# Altium schematic sheet Sheet1.SchDoc
size A
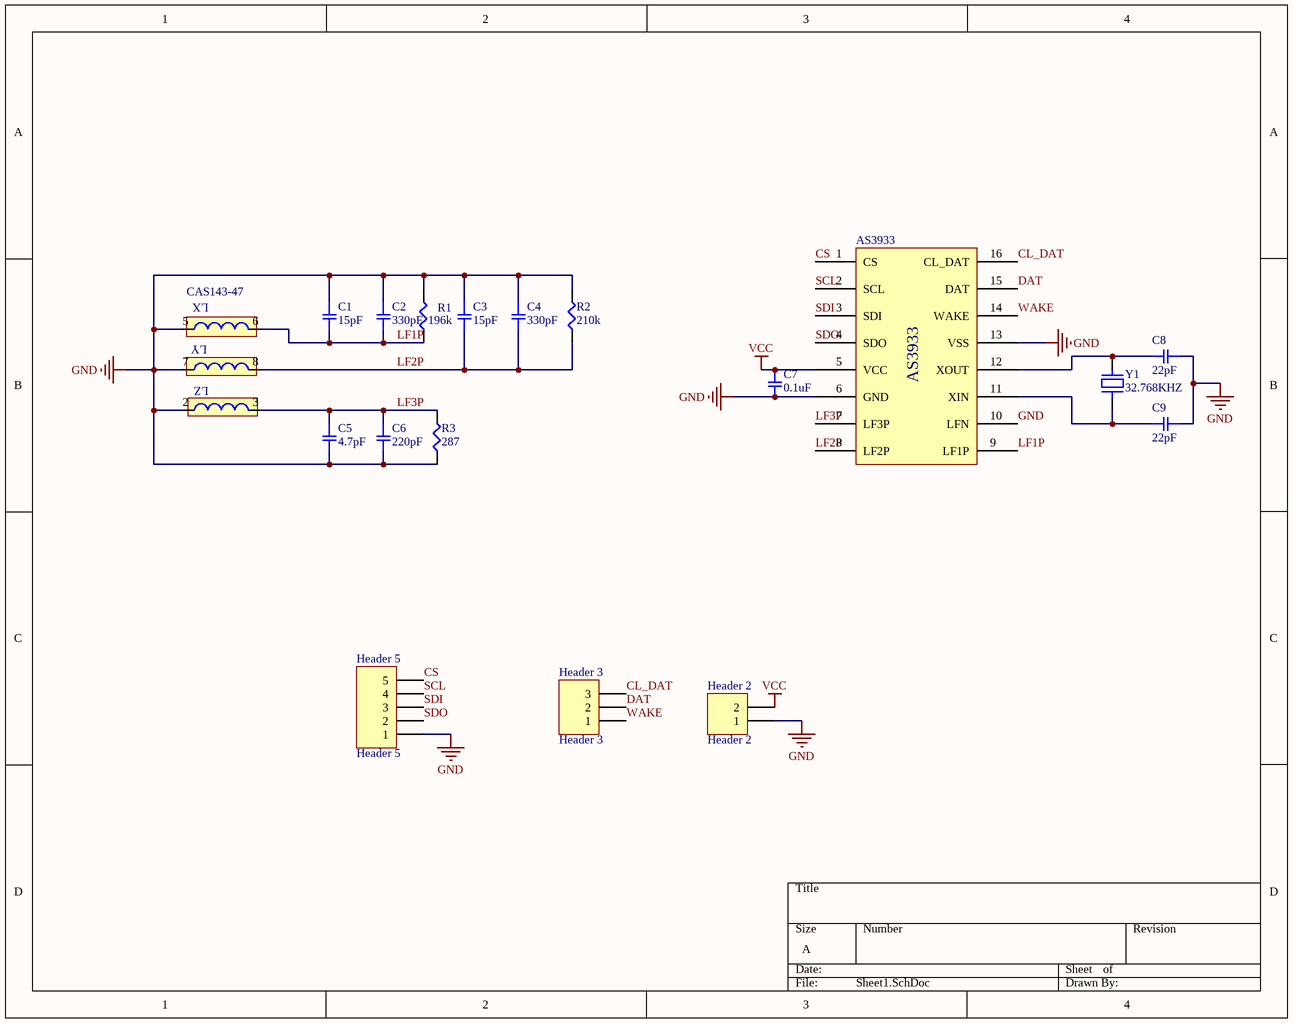
[diagram p0: Sheet1.SchDoc]

## Parts
AS3933  (no value)  [TSOP65P640X110-16N]
C1  15pF  [SMD-0805C]
C2  330pF  [SMD-0805C]
C3  15pF  [SMD-0805C]
C4  330pF  [SMD-0805C]
C5  4.7pF  [SMD-0805C]
C6  220pF  [SMD-0805C]
C7  0.1uF  [SMD-0805C]
C8  22pF  [SMD-0805C]
C9  22pF  [SMD-0805C]
CAS143-47  CAS143-47  [CAS143-47]  (value not drawn)
Header_2  Header 2  [HDR1X2]
Header_3  Header 3  [HDR1X3]
Header_5  Header 5  [HDR1X5]
R1  196k  [SMD-0805-RES]
R2  210k  [SMD-0805-RES]
R3  287  [SMD-0805-RES]
Y1  32.768KHZ  [ABRACON ABS07]

## Nets
GND: AS3933.6(GND) AS3933.10(LFN) AS3933.13(VSS) C1.1 C2.1 C3.1 C4.1 C5.2 C6.2 C7.2 C8.1 C9.1 CAS143-47.2 CAS143-47.5 CAS143-47.7 Header_2.1 Header_5.1 R1.2 R2.2 R3.1
VCC: AS3933.5(VCC) C7.1 Header_2.2
CL_DAT: AS3933.16(CL_DAT) Header_3.3
CS: AS3933.1(CS) Header_5.5
DAT: AS3933.15(DAT) Header_3.2
LF1P: AS3933.9(LF1P) C1.2 C2.2 CAS143-47.6 R1.1
LF2P: AS3933.8(LF2P) C3.2 C4.2 CAS143-47.8 R2.1
LF3P: AS3933.7(LF3P) C5.1 C6.1 CAS143-47.3 R3.2
SCL: AS3933.2(SCL) Header_5.4
SDI: AS3933.3(SDI) Header_5.3
SDO: AS3933.4(SDO) Header_5.2
WAKE: AS3933.14(WAKE) Header_3.1
NetAS3933_11: AS3933.11(XIN) C9.2 Y1.1
NetAS3933_12: AS3933.12(XOUT) C8.2 Y1.2

## Notes on the sheet
- (in symbol Component_1) LX; LY; LZ

## Library data of the parts
AS3933 CAS143-47 = Component_1
C1 C3 = CC0805FRNPO9BN150: Cap Ceramic 15pF 50V C0G 1%  0805; Manufacturer: Yaego; Part Number: CC0805FRNPO9BN150; Package / Case: 0805; Voltage: 50V; Tolerance: 1%; VALUE: 15pF
C2 C4 = CC0805GRNPO9BN331: Cap Ceramic 330pF 50V C0G 2%  0805; Manufacturer: Yageo; Part Number: CC0805GRNPO9BN331; Package / Case: 0805; Voltage: 50V; Tolerance: 2%; VALUE: 330pF
C5 = CL21C4R7BBANNNC: Cap Ceramic 4.7pF 50V C0G 0.1pF  0805; Manufacturer: Samsung Electro-Mechanics; Part Number: CL21C4R7BBANNNC; Package / Case: 0805; Voltage: 50V; Tolerance: 0.1pF; VALUE: 4.7pF
C6 = GCM2165C2A221FA16D: Cap Ceramic 220pF 100V C0G 1% 0805; Manufacturer: Murata Manufacturing; Part Number: GCM2165C2A221FA16D; Package / Case: 0805; Voltage: 100V; Tolerance: 1%; VALUE: 220pF
C7 = CL21B104JBCNNNC: CAP CER 0.1uF 50V X7T 0805; Part Number: GC321AD72E103KX01D; Manufacturer: Samsung Electro-Mechanics; Tolerance: 5%; Package / Case: 0805; Voltage: 50V; VALUE: 0.1uF
C8 C9 = CL21C220JBANNND: Cap Ceramic 22pF 50V C0G 5%0805; Manufacturer: Samsung Electro-Mechanics; Voltage: 100V; Tolerance: 1%; Part Number: CL21C220JBANNND; Package / Case: 0805; VALUE: 22pF
Header_2 = Header 2: Header, 2-Pin; LatestRevisionDate: 17-Jul-2002; LatestRevisionNote: Re-released for DXP Platform.; Publisher: Altium Limited
Header_3 = Header 3: Header, 3-Pin; LatestRevisionDate: 17-Jul-2002; LatestRevisionNote: Re-released for DXP Platform.; Publisher: Altium Limited
Header_5 = Header 5: Header, 5-Pin; LatestRevisionDate: 17-Jul-2002; LatestRevisionNote: Re-released for DXP Platform.; Publisher: Altium Limited
R1 = ERJ-6ENF1963V: RES SMD 196K OHM 1% 1/8W 0805; Manufacturer: Panasonic Electronic Components; Factory Stock: 0; Unit Price (USD): 0.00729; @ qty: 1500; Minimum Quantity: 1; Power (Watts): 0.125W, 1/8W; Temperature Coefficient: ±100ppm/°C; Part Number: ERJ-6ENF1963V; Datasheets: http://industrial.panasonic.com/www-cgi/jvcr13pz.cgi?E+PZ+3+AOA0002+ERJ6ENF1963V+7+WW; Image: //media.digikey.com/Renders/Panasonic%20Renders/ERJ-0805%20Pkg.jpg; Digi-Key Part Number: P196KCCT-ND; Quantity Available: 10095; Packaging: Cut Tape (CT); Series: ERJ; Part Status: Active; Value: 196k; Tolerance: ±1%; Composition: Thick Film; Features: Automotive AEC-Q200; Operating Temperature: -55°C ~ 155°C; Package / Case: 0805 (2012 Metric); Supplier Device Package: 0805; Size / Dimension: 0.079" L x 0.049" W (2.00mm x 1.25mm); Height - Seated (Max): 0.028" (0.70mm); Number of Terminations: 2; Failure Rate: -
R2 = ERJ-6ENF2103V: RES SMD 210K OHM 1% 1/8W 0805; Manufacturer: Panasonic Electronic Components; Factory Stock: 0; Unit Price (USD): 0.00729; @ qty: 1500; Minimum Quantity: 1; Power (Watts): 0.125W, 1/8W; Temperature Coefficient: ±100ppm/°C; Part Number: ERJ-6ENF2103V; Datasheets: http://industrial.panasonic.com/www-cgi/jvcr13pz.cgi?E+PZ+3+AOA0002+ERJ6ENF2103V+7+WW; Image: //media.digikey.com/Renders/Panasonic%20Renders/ERJ-0805%20Pkg.jpg; Digi-Key Part Number: P210KCCT-ND; Quantity Available: 47308; Packaging: Cut Tape (CT); Series: ERJ; Part Status: Active; Value: 210k; Tolerance: ±1%; Composition: Thick Film; Features: Automotive AEC-Q200; Operating Temperature: -55°C ~ 155°C; Package / Case: 0805 (2012 Metric); Supplier Device Package: 0805; Size / Dimension: 0.079" L x 0.049" W (2.00mm x 1.25mm); Height - Seated (Max): 0.028" (0.70mm); Number of Terminations: 2; Failure Rate: -
R3 = ERJ-6ENF2870V: RES SMD 287 OHM 1% 1/8W 0805; Manufacturer: Panasonic Electronic Components; Factory Stock: 0; Unit Price (USD): 0.00729; @ qty: 1500; Minimum Quantity: 1; Power (Watts): 0.125W, 1/8W; Temperature Coefficient: ±100ppm/°C; Part Number: ERJ-6ENF2870V; Datasheets: http://industrial.panasonic.com/www-cgi/jvcr13pz.cgi?E+PZ+3+AOA0002+ERJ6ENF2870V+7+WW; Image: //media.digikey.com/Renders/Panasonic%20Renders/ERJ-0805%20Pkg.jpg; Digi-Key Part Number: P287CCT-ND; Quantity Available: 41477; Packaging: Cut Tape (CT); Series: ERJ; Part Status: Active; Value: 287; Tolerance: ±1%; Composition: Thick Film; Features: Automotive AEC-Q200; Operating Temperature: -55°C ~ 155°C; Package / Case: 0805 (2012 Metric); Supplier Device Package: 0805; Size / Dimension: 0.079" L x 0.049" W (2.00mm x 1.25mm); Height - Seated (Max): 0.028" (0.70mm); Number of Terminations: 2; Failure Rate: -
Y1 = Abracon Crystal ABS07: SMT Crystal; VALUE: 32.768KHZ